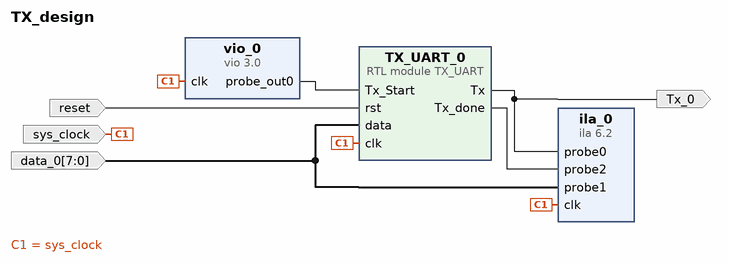
[diagram p0: block diagram of the top level]
# Vivado block design TX_design, xc7a35ticsg324-1L, Vivado 2020.2.2
create_bd_design TX_design

create_bd_port -dir I -type clk sys_clock
set_property -dict {CONFIG.FREQ_HZ 100000000 CONFIG.PHASE 0.000} [get_bd_ports sys_clock]
create_bd_port -dir I -type rst reset
set_property -dict {CONFIG.POLARITY ACTIVE_LOW} [get_bd_ports reset]
create_bd_port -dir O Tx_0
create_bd_port -dir I -from 7 -to 0 data_0

create_bd_cell -type ip -vlnv xilinx.com:ip:ila:6.2 ila_0
set_property -dict [list \
  CONFIG.C_ENABLE_ILA_AXI_MON false \
  CONFIG.C_MONITOR_TYPE Native \
  CONFIG.C_NUM_OF_PROBES 3 \
  CONFIG.C_PROBE1_WIDTH 8 \
] [get_bd_cells ila_0]
create_bd_cell -type module -reference TX_UART TX_UART_0
create_bd_cell -type ip -vlnv xilinx.com:ip:vio:3.0 vio_0
set_property -dict [list \
  CONFIG.C_NUM_PROBE_IN 0 \
  CONFIG.C_NUM_PROBE_OUT 1 \
  CONFIG.C_PROBE_IN0_WIDTH 8 \
  CONFIG.C_PROBE_OUT0_WIDTH 1 \
] [get_bd_cells vio_0]

# ---- connections ----

connect_bd_net [get_bd_pins TX_UART_0/Tx_done] [get_bd_pins ila_0/probe2]
connect_bd_net -net clk_wiz_0_clk_out1 [get_bd_ports sys_clock] [get_bd_pins ila_0/clk] [get_bd_pins TX_UART_0/clk] [get_bd_pins vio_0/clk]
connect_bd_net [get_bd_ports reset] [get_bd_pins TX_UART_0/rst]
connect_bd_net -net Tx [get_bd_pins TX_UART_0/Tx] [get_bd_ports Tx_0] [get_bd_pins ila_0/probe0]
connect_bd_net -net data_0_1 [get_bd_ports data_0] [get_bd_pins ila_0/probe1] [get_bd_pins TX_UART_0/data]
connect_bd_net [get_bd_pins vio_0/probe_out0] [get_bd_pins TX_UART_0/Tx_Start]

validate_bd_design
save_bd_design
